# EasyEDA schematic STROBO_PWRIN.json
TITLE: Sheet_1; REV: 1.0; Date: 2019-12-15; Sheet: 1/1; Drawn By: NickF93; Company: Your Company
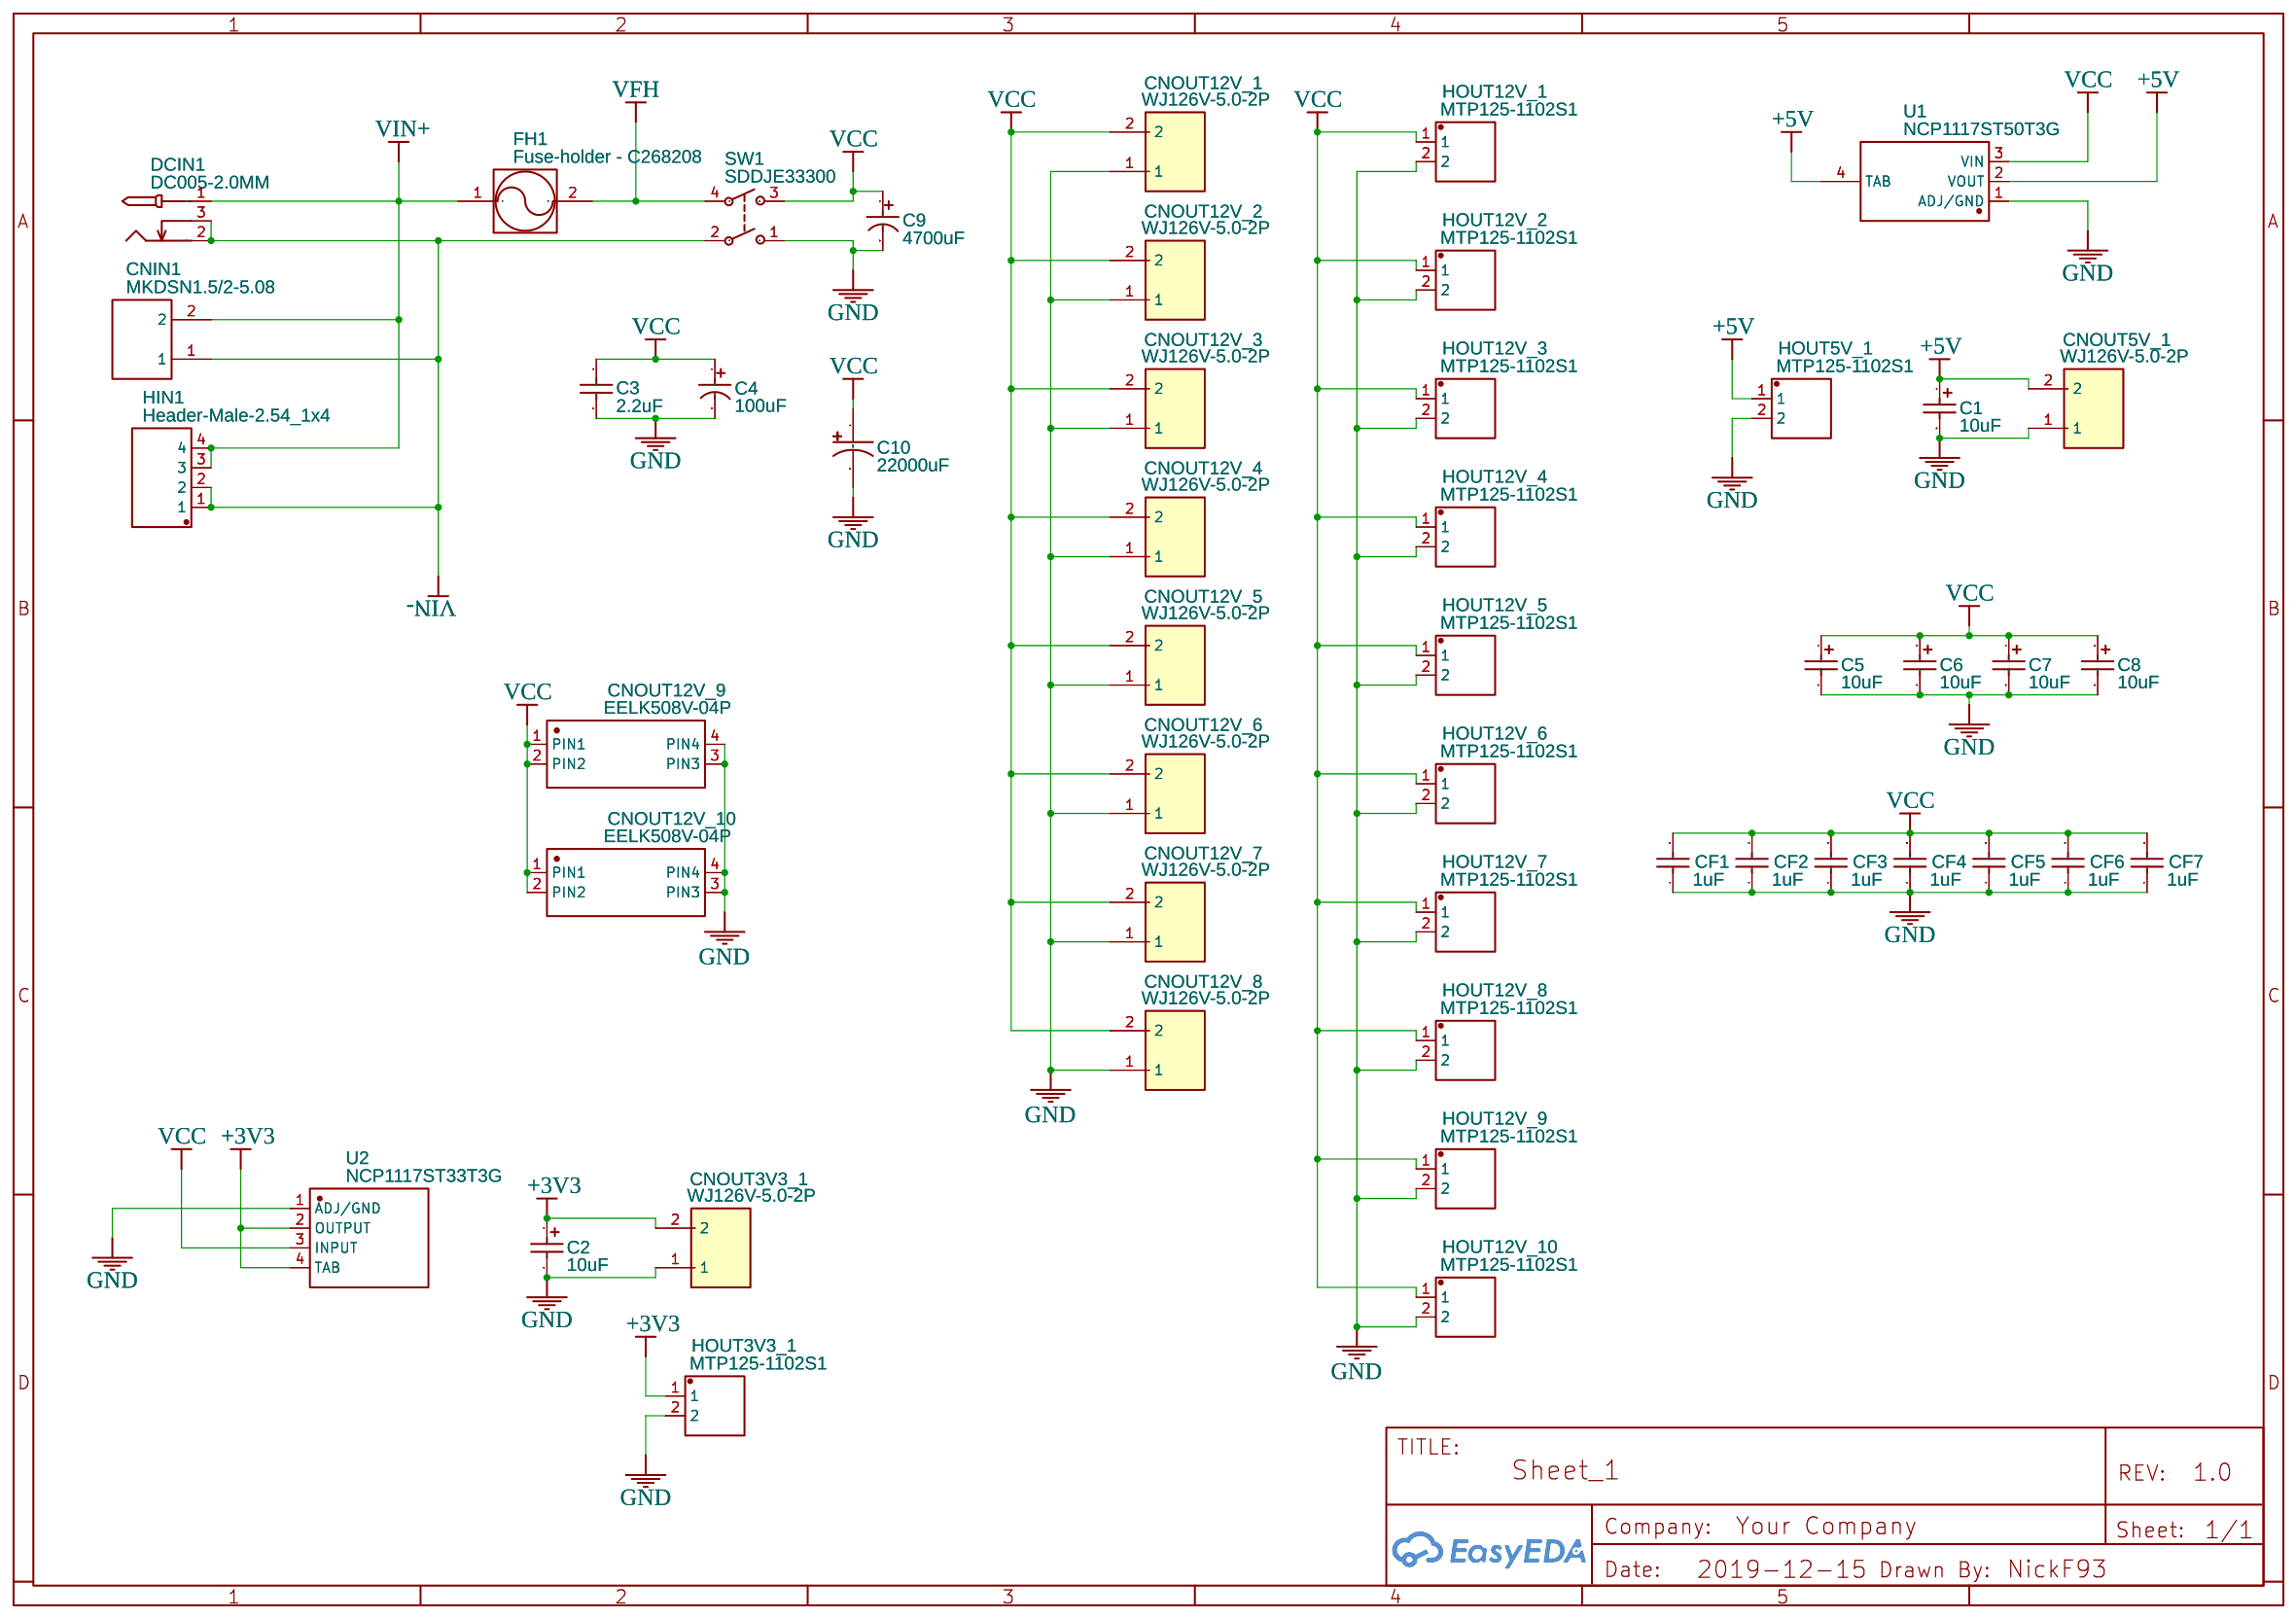
[diagram p0: schematic sheet]

## Parts
C1  10uF  [CAP-TAN-S2.5]
C2  10uF  [CAP-TAN-S2.5]
C3  2.2uF  [CAP-0.2]
C4  100uF  [CAP-TH_BD6.3-P2.50-D1.0-FD]
C5  10uF  [CAP-TAN-S2.5]
C6  10uF  [CAP-TAN-S2.5]
C7  10uF  [CAP-TAN-S2.5]
C8  10uF  [CAP-TAN-S2.5]
C9  4700uF  [CAP-TH_BD16.0-P7.50-D1.2-FD]
C10  22000uF  [CAP-TH_BD35.0-P10.00-D2.3-FD]
CF1  1uF  [CAP-0.2]
CF2  1uF  [CAP-0.2]
CF3  1uF  [CAP-0.2]
CF4  1uF  [CAP-0.2]
CF5  1uF  [CAP-0.2]
CF6  1uF  [CAP-0.2]
CF7  1uF  [CAP-0.2]
CNIN1  MKDSN1.5/2-5.08  [MKDSN1.5/2-5.08]
CNOUT3V3_1  WJ126V-5.0-2P  [WJ126V-5.0-2P]
CNOUT5V_1  WJ126V-5.0-2P  [WJ126V-5.0-2P]
CNOUT12V_1  WJ126V-5.0-2P  [WJ126V-5.0-2P]
CNOUT12V_2  WJ126V-5.0-2P  [WJ126V-5.0-2P]
CNOUT12V_3  WJ126V-5.0-2P  [WJ126V-5.0-2P]
CNOUT12V_4  WJ126V-5.0-2P  [WJ126V-5.0-2P]
CNOUT12V_5  WJ126V-5.0-2P  [WJ126V-5.0-2P]
CNOUT12V_6  WJ126V-5.0-2P  [WJ126V-5.0-2P]
CNOUT12V_7  WJ126V-5.0-2P  [WJ126V-5.0-2P]
CNOUT12V_8  WJ126V-5.0-2P  [WJ126V-5.0-2P]
CNOUT12V_9  EELK508V-04P  [EELK508V-04P]
CNOUT12V_10  EELK508V-04P  [EELK508V-04P]
DCIN1  DC005-2.0MM  [DC-5020]
FH1  Fuse-holder - C268208  [FUSE-HOLDER- C268208]
HIN1  Header-Male-2.54_1x4  [DIP-1X4P-2.54MM-M]
HOUT3V3_1  MTP125-1102S1  [HDR-TH_2P-P2.54-V_A2541HWV-2P]
HOUT5V_1  MTP125-1102S1  [HDR-TH_2P-P2.54-V_A2541HWV-2P]
HOUT12V_1  MTP125-1102S1  [HDR-TH_2P-P2.54-V_A2541HWV-2P]
HOUT12V_2  MTP125-1102S1  [HDR-TH_2P-P2.54-V_A2541HWV-2P]
HOUT12V_3  MTP125-1102S1  [HDR-TH_2P-P2.54-V_A2541HWV-2P]
HOUT12V_4  MTP125-1102S1  [HDR-TH_2P-P2.54-V_A2541HWV-2P]
HOUT12V_5  MTP125-1102S1  [HDR-TH_2P-P2.54-V_A2541HWV-2P]
HOUT12V_6  MTP125-1102S1  [HDR-TH_2P-P2.54-V_A2541HWV-2P]
HOUT12V_7  MTP125-1102S1  [HDR-TH_2P-P2.54-V_A2541HWV-2P]
HOUT12V_8  MTP125-1102S1  [HDR-TH_2P-P2.54-V_A2541HWV-2P]
HOUT12V_9  MTP125-1102S1  [HDR-TH_2P-P2.54-V_A2541HWV-2P]
HOUT12V_10  MTP125-1102S1  [HDR-TH_2P-P2.54-V_A2541HWV-2P]
SW1  SDDJE33300  [SW-TH_4PIN_SDDJE33300]
U1  NCP1117ST50T3G  [SOT-223_L6.5-W3.5-P2.30-LS7.0-BR]
U2  NCP1117ST33T3G  [SOT-223-3_L6.5-W3.4-P2.30-LS7.0-BR]

## Library data of the parts
C1 C2 C5-C8 = TAP106K025SCS: Supplier: LCSC; Manufacturer: AVX; Supplier Part: C28244
C3 = CD1H225KC9BER1F000: Supplier: LCSC; Supplier Part: C263192; Manufacturer: Dersonic; Contributor: LCSC
C4 = 100uF 50V 6.3*12Black high frequency: Supplier: LCSC; Manufacturer: ValuePro; Supplier Part: C47891
C9 = 4700uF 25V 16*25V: Supplier: LCSC; Manufacturer: ValuePro; Supplier Part: C45070
C10 = PP2291IMT452RB: Supplier: LCSC; Supplier Part: C406796; Manufacturer: Xunda; Contributor: LCSC
CF1-CF7 = CD1H105MC9BEF4E000: Supplier: LCSC; Supplier Part: C263189; Manufacturer: Dersonic; Contributor: LCSC
CNIN1 = -: Supplier: LCSC; Manufacturer: Phoenix Contact; Supplier Part: C91153
CNOUT3V3_1 CNOUT5V_1 CNOUT12V_1-CNOUT12V_8 = WJ126V-5.0-2P: Supplier: LCSC; Manufacturer: ReliaPro; image: //image.lceda.cn/szlcsc/C8404.jpg; Supplier Part: C8404
CNOUT12V_9 CNOUT12V_10 = EELK508V-04P: Supplier: LCSC; Manufacturer: Dinkle; Contributor: LCSC; Supplier Part: C99398
DCIN1 = -: Supplier: LCSC; Manufacturer: SOFNG; Supplier Part: C111567
FH1 = -: Supplier Part: C268208; Supplier: LCSC; Contributor: AGRATX
HIN1 = -: Supplier: LCSC; Manufacturer: Ckmtw; Manufacturer Part: 210S-1*4P L=11.6MMGold-plated black; Contributor: LCSC; Supplier Part: C124378
HOUT3V3_1 HOUT5V_1 HOUT12V_1-HOUT12V_10 = MTP125-1102S1: Supplier: LCSC; Supplier Part: C358684; Manufacturer: MINTRON; Contributor: LCSC
SW1 = -: Supplier: LCSC; Supplier Part: C278327; Manufacturer: ALPS Electric; Contributor: LCSC
U1 = -: Supplier: LCSC; Manufacturer: ON; image: //image.lceda.cn/szlcsc/C17314.jpg; Supplier Part: C17314; LCSC Assembly: Yes; SMT Type: Extend
U2 = -: Supplier: LCSC; Manufacturer: ON; image: //image.lceda.cn/szlcsc/C26537.jpg; Supplier Part: C26537; LCSC Assembly: Yes; SMT Type: Extend

## Nets
+3V3: C2.1 CNOUT3V3_1.2 HOUT3V3_1.1 U2.2(OUTPUT) U2.4(TAB)
+5V: C1.1 CNOUT5V_1.2 HOUT5V_1.1 U1.2(VOUT) U1.4(TAB)
GND: C1.2 C2.2 C3.1 C4.2 C5.2 C6.2 C7.2 C8.2 C9.2 C10.2 CF1.1 CF2.1 CF3.1 CF4.1 CF5.1 CF6.1 CF7.1 CNOUT3V3_1.1 CNOUT5V_1.1 CNOUT12V_1.1 CNOUT12V_2.1 CNOUT12V_3.1 CNOUT12V_4.1 CNOUT12V_5.1 CNOUT12V_6.1 CNOUT12V_7.1 CNOUT12V_8.1 CNOUT12V_9.3(PIN3) CNOUT12V_9.4(PIN4) CNOUT12V_10.3(PIN3) CNOUT12V_10.4(PIN4) HOUT3V3_1.2 HOUT5V_1.2 HOUT12V_1.2 HOUT12V_2.2 HOUT12V_3.2 HOUT12V_4.2 HOUT12V_5.2 HOUT12V_6.2 HOUT12V_7.2 HOUT12V_8.2 HOUT12V_9.2 HOUT12V_10.2 SW1.1 U1.1(ADJ/GND) U2.1(ADJ/GND)
VCC: C3.2 C4.1 C5.1 C6.1 C7.1 C8.1 C9.1 C10.1 CF1.2 CF2.2 CF3.2 CF4.2 CF5.2 CF6.2 CF7.2 CNOUT12V_1.2 CNOUT12V_2.2 CNOUT12V_3.2 CNOUT12V_4.2 CNOUT12V_5.2 CNOUT12V_6.2 CNOUT12V_7.2 CNOUT12V_8.2 CNOUT12V_9.1(PIN1) CNOUT12V_9.2(PIN2) CNOUT12V_10.1(PIN1) CNOUT12V_10.2(PIN2) HOUT12V_1.1 HOUT12V_2.1 HOUT12V_3.1 HOUT12V_4.1 HOUT12V_5.1 HOUT12V_6.1 HOUT12V_7.1 HOUT12V_8.1 HOUT12V_9.1 HOUT12V_10.1 SW1.3 U1.3(VIN) U2.3(INPUT)
VIN+: CNIN1.2 DCIN1.1 FH1.1 HIN1.3 HIN1.4
VIN-: CNIN1.1 DCIN1.2 DCIN1.3 HIN1.1 HIN1.2 SW1.2
VFH: FH1.2 SW1.4
